# EAGLE design plantSensor (EAGLE 6.4)
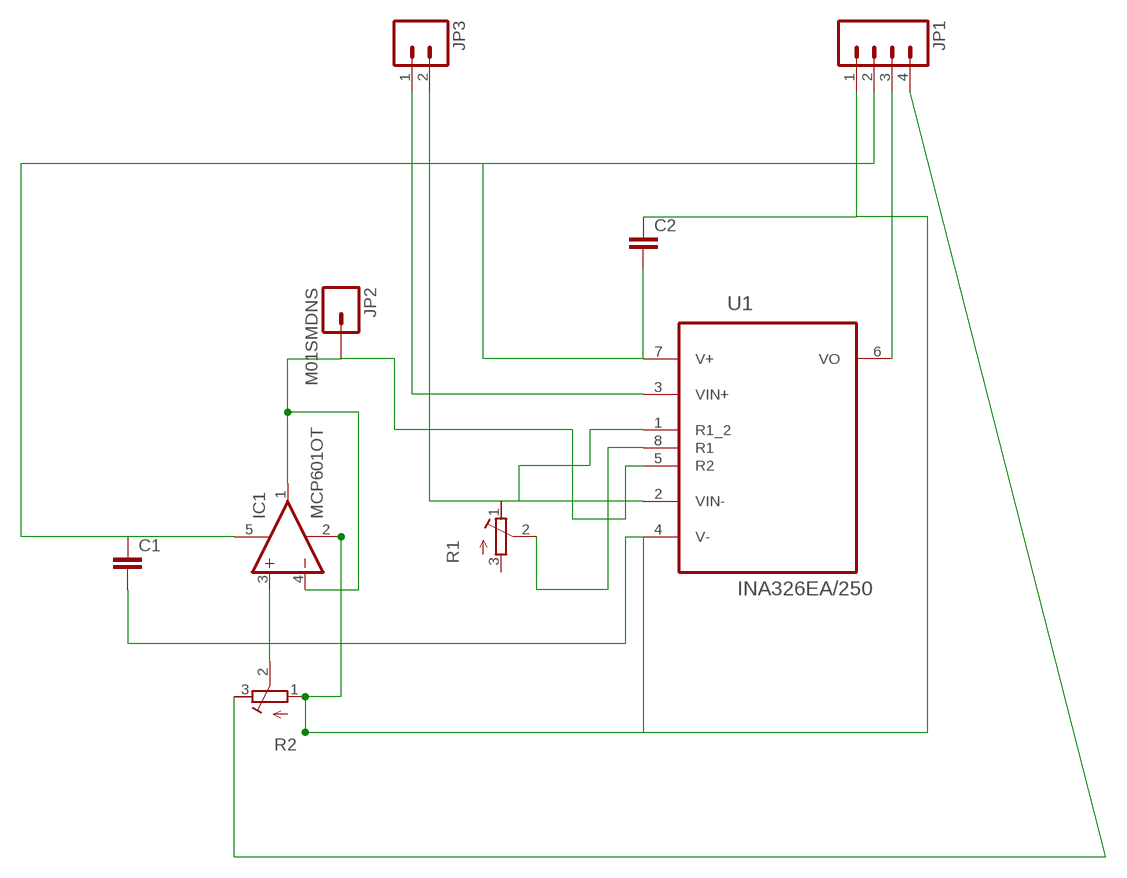
[diagram p0: schematic, sheet 1]

## Parts
C1  C2.5/4  [C2.5-4]
C2  C2.5/4  [C2.5-4]
IC1  MCP601OT  [SOT23-5]
JP1  M04PTH  [1X04]
JP2  M01SMDNS  [1X01NS]
JP3  M02PTH  [1X02]
R1  R-TRIMM3314G  [RTRIM3314G]
R2  R-TRIMM3314J  [RTRIM3314J]
U1  INA326EA/250  [SOP65P490X110-8N]

## Nets
AA: C1.1 C2.2 IC1.5(V+) JP1.2 U1.7(V+)
GND: C1.2 C2.1 IC1.2(V-) JP1.1 R2.1(E) U1.4(V-)
N$1: JP1.3 U1.6(VO)
N$3: IC1.3(+IN) R2.2(S)
N$20: JP3.2 U1.2(VIN-)
N$21: JP3.1 U1.3(VIN+)
N$23: R1.2(S) U1.8(R1)
N$49: R1.1(E) U1.1(R1_2)
N$57: JP1.4 R2.3(A)
N$88: IC1.1(OUT) IC1.4(-IN) JP2.1 U1.5(R2)
Unconnected: R1.3(A)

## Library data of the parts
C1 C2 = capacitor-wima:C: CAPACITOR naming: grid - package width
IC1 = linear:MCP601: Single Op Amp 2.7V to 6.0V Single Supply CMOS Source: http://ww1.microchip.com/downloads/en/DeviceDoc/21314g.pdf
JP1 = SparkFun-Connectors:M04: Header 4 Standard 4-pin 0.1" header. Use with straight break away headers (SKU : PRT-00116), right angle break away headers (PRT-00553), swiss pins (PRT-00743), machine pins (PRT-00117), and female headers (PRT-00115). Molex polarized connector foot print use with SKU : PRT-08231 with associated crimp pins and housings. 1MM SMD Version SKU: PRT-10208
JP2 = SparkFun-Connectors:M01: Header 1 Standard 1-pin 0.1" header. Use with straight break away headers (SKU : PRT-00116), right angle break away headers (PRT-00553), swiss pins (PRT-00743), machine pins (PRT-00117), and female headers (PRT-00115).
JP3 = SparkFun-Connectors:M02: Header 2 Standard 2-pin 0.1" header. Use with straight break away headers (SKU : PRT-00116), right angle break away headers (PRT-00553), swiss pins (PRT-00743), machine pins (PRT-00117), and female headers (PRT-00115). Molex polarized connector foot print use with SKU : PRT-08233 with associated crimp pins and housings.
R1 = rcl:R-TRIMM: Trimm resistor
R2 = resistor:R-TRIMM: Trimm resistor
U1 = Texas Instruments_By_element14_Batch_1:INA326EA/250: Precision, Rail-to-Rail I/O INSTRUMENTATION AMPLIFIER; MPN: INA326EA/250; OC_FARNELL: 1218192; OC_NEWARK: 74K3817; PACKAGE: MSOP-8; SUPPLIER: Texas Instruments

## Board
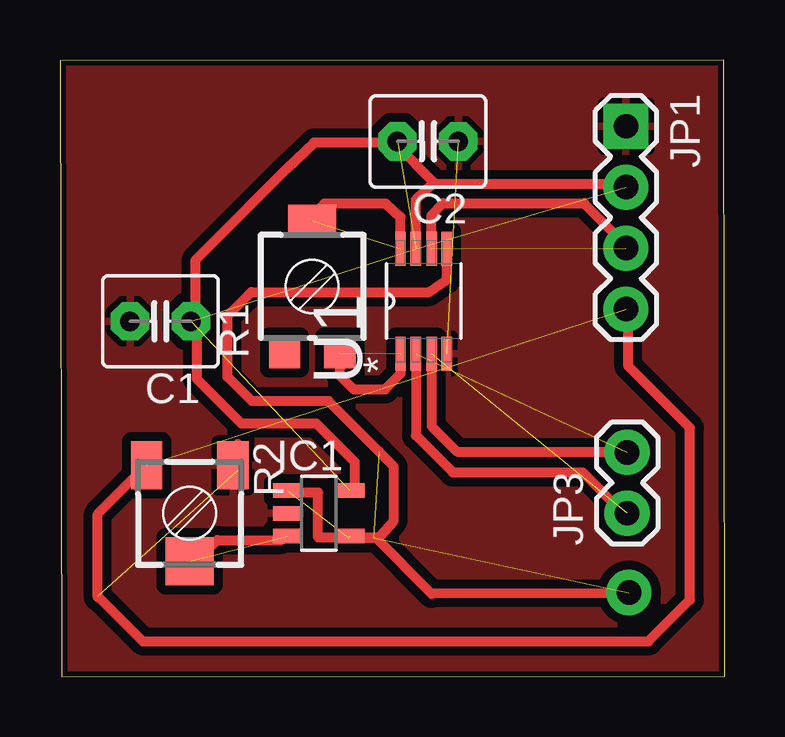
[diagram p1: board, top side]
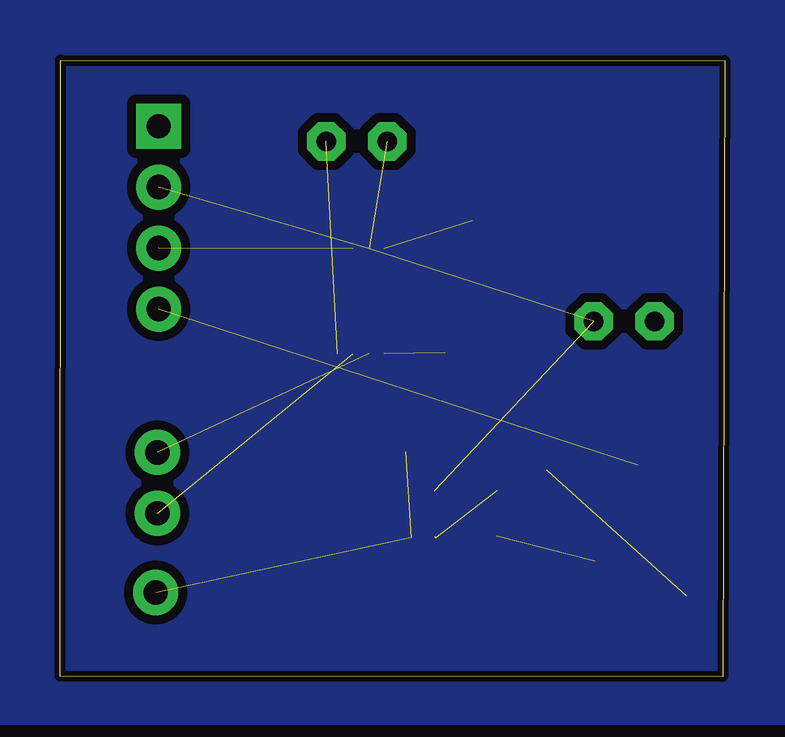
[diagram p2: board, bottom side, seen from below]

Size 27.71 x 25.69 mm. Coordinates in mm from the lower left corner, seen from the top.
Outline: 0.08,0 27.71,0.03 27.69,25.7 0,25.67 0.08,0
Copper layers (1*16): Top 0.035mm / dielectric 1.5mm / Bottom 0.035mm
Design rules "default *": minimum track width 10mil, minimum drill 24mil, track to track 15mil, track to pad 15mil, pad to pad 15mil, via to via 15mil, smd to smd 15mil, copper to edge 9mil, drill to drill 8mil, minimum pad ring 10mil, minimum via ring 8mil, stop-mask expansion 4mil, vias tented up to drill 0mil, thermal gap 10mil

### Footprints (pad centres in the part's own frame; a part is rotated, then mirrored left to right if it is on the bottom)
C2.5-4 = drill 0.813 pad 1.6 octagon: 1 -1.27,0; 2 1.27,0
SOT23-5 = smd 0.6 x 1.2: 1 -0.95,-1.306; 2 0,-1.306; 3 0.95,-1.306; 4 0.95,1.306; 5 -0.95,1.306
1X04 = drill 1.016 pad 1.88 square: 1 0,0 | drill 1.016 pad 1.88: 2 2.54,0; 3 5.08,0; 4 7.62,0
1X01NS = drill 1.016 pad 1.88: 1 0,0
1X02 = drill 1.016 pad 1.88: 1 0,0; 2 2.54,0
RTRIM3314G = smd 1.3 x 1.3: 1 1.15,-2.75; 3 -1.15,-2.75 | smd 2 x 1.3: 2 0,2.75
RTRIM3314J = smd 1.3 x 2: 1 -1.8,-2; 3 1.8,-2 | smd 2 x 2: 2 0,2
SOP65P490X110-8N = smd 1.422 x 0.432: 1 -2.184,0.965; 2 -2.184,0.33; 3 -2.184,-0.33; 4 -2.184,-0.965; 5 2.184,-0.965; 6 2.184,-0.33; 7 2.184,0.33; 8 2.184,0.965

### Placement (x,y rotation side)
C1  4.19,14.81 180 top
C2  15.34,22.3 180 top
IC1  10.8,6.81 270 top
JP1  23.6,22.94 270 top
JP2  23.72,3.51 0 top
JP3  23.65,6.81 90 top
R1  10.52,16.26 0 top
R2  5.41,6.81 180 top
U1  15.16,15.65 90 top

### Tracks (layer width: path | path; a pad name or v marks a point on that pad's centre or on a via)
AA  (4 unrouted)
GND  (1 unrouted)
  pour Top: -3.3,32.03 33.12,32.11 33.43,-2.21 -2.11,-2.11
N$1  (1 unrouted)
N$3  (1 unrouted)
N$8
  Top 0.406: 13.26,5.77 13.33,5.84 13.92,6.5 13.92,8.74 13.31,9.37
N$12
  Top 0.406: 5.61,4.57 5.61,4.75 6.55,5.69 9.22,5.69 9.42,5.89
N$20  (1 unrouted)
N$21  (1 unrouted)
N$23  (1 unrouted)
N$49  (1 unrouted)
N$50
  Top 0.305: 11.73,12.98 11.66,13.06
N$51
  Top 0.305: 10.95,18.62 10.9,18.57
N$53
  pour Bottom: -4.47,35.2 36.12,35.2 36.12,-1.85 -4.55,-1.85 -4.55,35.31
N$57  (1 unrouted)
N$63
  Top 0.406: 15.49,17.93 15.49,19.23 15.98,19.74 21.84,19.74 23.7,17.88
N$68
  Top 0.406: 14.83,17.83 14.83,19.86 15.6,20.57 | 15.6,20.57 15.67,20.55 23.44,20.55 23.7,20.3 | 14.25,22.07 13.97,22.23 15.6,20.57
N$75  (1 unrouted)
  Top 0.406: 7.42,8.61 7.42,9.7 | 1.57,3.35 3.45,1.47 24.54,1.47 26.26,3.2 26.26,10.36 23.7,12.93 23.7,15.47
N$76
  Top 0.406: 1.57,3.3 1.57,6.78 3.76,8.97
N$78
  Top 0.406: 23.82,3.48 15.49,3.45 13.18,5.79
N$79
  Top 0.406: 13.33,5.79 11.76,5.79
N$81
  Top 0.406: 14.02,22.25 10.59,22.25 9.42,21.13 5.64,17.35 5.64,14.81 5.46,14.63
N$82
  Top 0.406: 14.2,17.78 14.2,19.15 13.59,19.71 11.02,19.71 10.31,19
N$84
  Top 0.406: 15.49,13.66 15.49,10.44 16.56,9.37 23.82,9.37
N$85
  Top 0.406: 14.83,13.59 14.83,10.06 16.38,8.51 21.79,8.51 23.52,6.78
N$86
  Top 0.406: 12.29,7.8 12.29,8.94 10.69,10.54 7.57,10.54 5.71,12.4 5.71,14.83 5.61,14.94
N$87
  Top 0.406: 11.89,5.79 10.77,5.79 10.77,7.67 9.52,7.67
N$88  (4 unrouted)
  Top 0.406: 12.04,5.79 13.08,5.79 | 13.31,9.37 11.2,11.48 8,11.48 6.98,12.5 6.98,15.04 7.98,16.03 15.39,16.03 16.13,16.54 U1.5
N$89
  Top 0.406: 14.2,13.56 14.2,12.62 13.54,11.96
N$90
  Top 0.406: 13.56,11.96 12.27,11.96 11.68,12.55 11.68,13.41 11.71,13.44